# Altium schematic sheet LCDTFT_FPC30P_LVDS_SCT070013.SchDoc
size A3
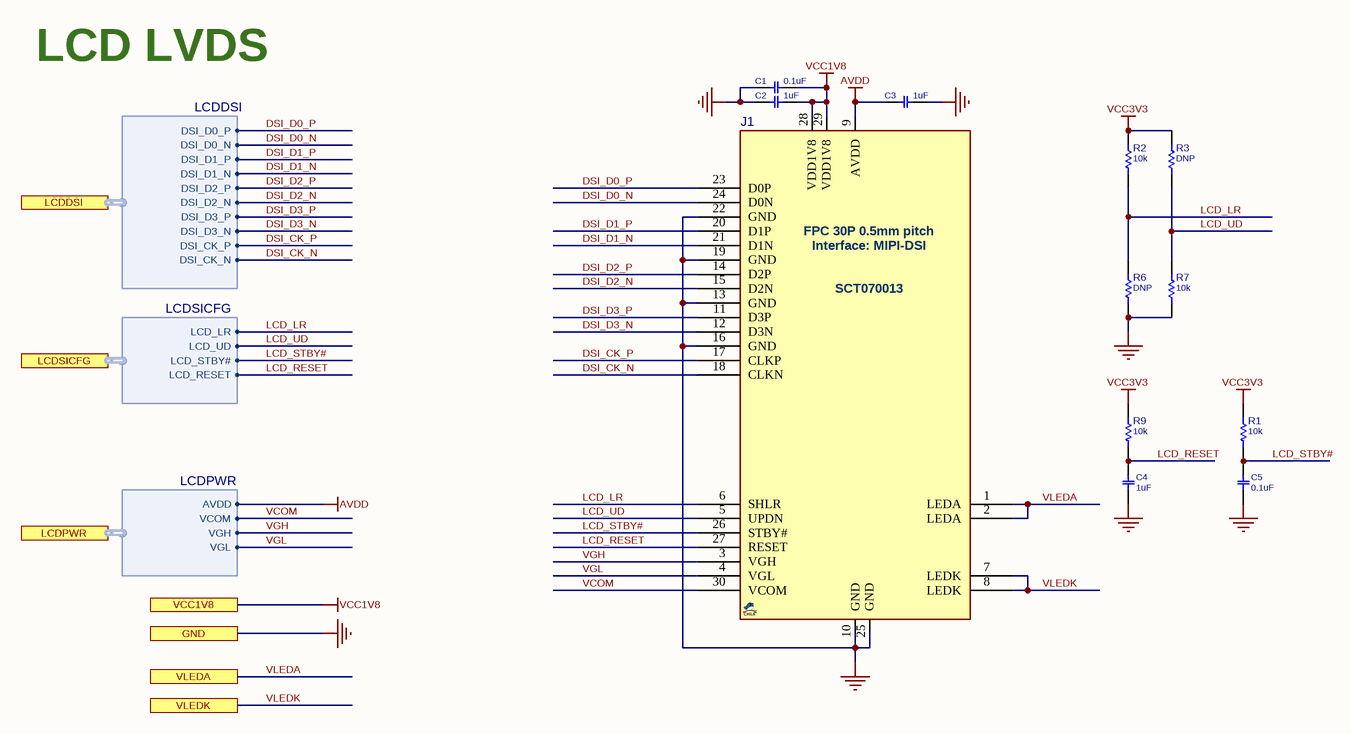
[diagram p0: LCDTFT_FPC30P_LVDS_SCT070013.SchDoc]

## Parts
C1  0.1uF  [C0402]
C2  1uF  [C0402]
C3  1uF  [C0402]
C4  1uF  [C0402]
C5  0.1uF  [C0402]
J1  FPC_30_0.5mm  [FPC50_30]  (value not drawn)
R1  10k  [R0402]
R2  10k  [R0402]
R3  DNP  [R0402]
R6  DNP  [R0402]
R7  10k  [R0402]
R9  10k  [R0402]

## Ports
GND, LCDDSI (harness LCDDSI), LCDPWR (harness LCDPWR), LCDSICFG (harness LCDSICFG), VCC1V8, VLEDA, VLEDK

## Harnesses
LCDDSI: DSI_D0_P, DSI_D0_N, DSI_D1_P, DSI_D1_N, DSI_D2_P, DSI_D2_N, DSI_D3_P, DSI_D3_N, DSI_CK_P, DSI_CK_N
LCDPWR: AVDD, VGH, VCOM, VGL
LCDSICFG: LCD_LR, LCD_UD, LCD_STBY#, LCD_RESET

## Nets
AVDD: C3.2 J1.9(AVDD) ; port LCDPWR.AVDD
GND: C1.2 C2.2 C3.1 C4.2 C5.2 J1.10(GND) J1.13(GND) J1.16(GND) J1.19(GND) J1.22(GND) J1.25(GND) R6.2 R7.2 ; port GND
VCC1V8: C1.1 C2.1 J1.28(VDD1V8) J1.29(VDD1V8) ; port VCC1V8
VCC3V3: R1.1 R2.1 R3.1 R9.1
DSI_CK_N: J1.18(CLKN) ; port LCDDSI.DSI_CK_N
DSI_CK_P: J1.17(CLKP) ; port LCDDSI.DSI_CK_P
DSI_D0_N: J1.24(D0N) ; port LCDDSI.DSI_D0_N
DSI_D0_P: J1.23(D0P) ; port LCDDSI.DSI_D0_P
DSI_D1_N: J1.21(D1N) ; port LCDDSI.DSI_D1_N
DSI_D1_P: J1.20(D1P) ; port LCDDSI.DSI_D1_P
DSI_D2_N: J1.15(D2N) ; port LCDDSI.DSI_D2_N
DSI_D2_P: J1.14(D2P) ; port LCDDSI.DSI_D2_P
DSI_D3_N: J1.12(D3N) ; port LCDDSI.DSI_D3_N
DSI_D3_P: J1.11(D3P) ; port LCDDSI.DSI_D3_P
LCD_LR: J1.6(SHLR) R2.2 R6.1 ; port LCDSICFG.LCD_LR
LCD_RESET: C4.1 J1.27(RESET) R9.2 ; port LCDSICFG.LCD_RESET
LCD_STBY#: C5.1 J1.26(STBY#) R1.2 ; port LCDSICFG.LCD_STBY#
LCD_UD: J1.5(UPDN) R3.2 R7.1 ; port LCDSICFG.LCD_UD
VCOM: J1.30(VCOM) ; port LCDPWR.VCOM
VGH: J1.3(VGH) ; port LCDPWR.VGH
VGL: J1.4(VGL) ; port LCDPWR.VGL
VLEDA: J1.1(LEDA) J1.2(LEDA) ; port VLEDA
VLEDK: J1.7(LEDK) J1.8(LEDK) ; port VLEDK

## Notes on the sheet
- LCD LVDS
- (in symbol LCDTFT_DSI_FPC30P_SCT070013) FPC 30P 0.5mm pitch; Interface: MIPI-DSI; SCT070013

## Library data of the parts
C1 C5 = CAP_SMD_MLCC: CAP, MLCC; PARAM: X7R, 10%, -55~125oC; MANF_P#: GRM155R71H104KE14D; MANF: Murata; PARAM2: 50v; PRICE: 100: 0.018$; ASSEMBLY: ASSEMBLY; VALUE: 0.1uF
C2-C4 = CAP_SMD_MLCC: CAP, MLCC; PARAM: X5R, 10%; MANF_P#: CL05A105KO5NNND; MANF: Samsung; PARAM2: 16v; PRICE: 50,000:	$0.006; ASSEMBLY: ASSEMBLY; VALUE: 1uF
J1 = LCDTFT_DSI_FPC30P_SCT070013: LCD TFT Color, FPC30P, LVDS; MANF: -; MANF_P#: -; PARAM: -; VALUE: FPC_30_0.5mm
R1-R3 R6 R7 R9 = RES_SMD: RESISTOR, SMD; PARAM: 0.063W; DESC: DESCRIPTION; DIST#: MOUSER; PARAM2: 1%; MANF_P#: -; MANF: -; ASSEMBLY: ASSEMBLY; PRICE: 100= 0.3$
  R1 R2 R7 R9: VALUE: 10k
  R3 R6: VALUE: DNP